# Altium schematic sheet Giao_Thong.SchDoc
size A3
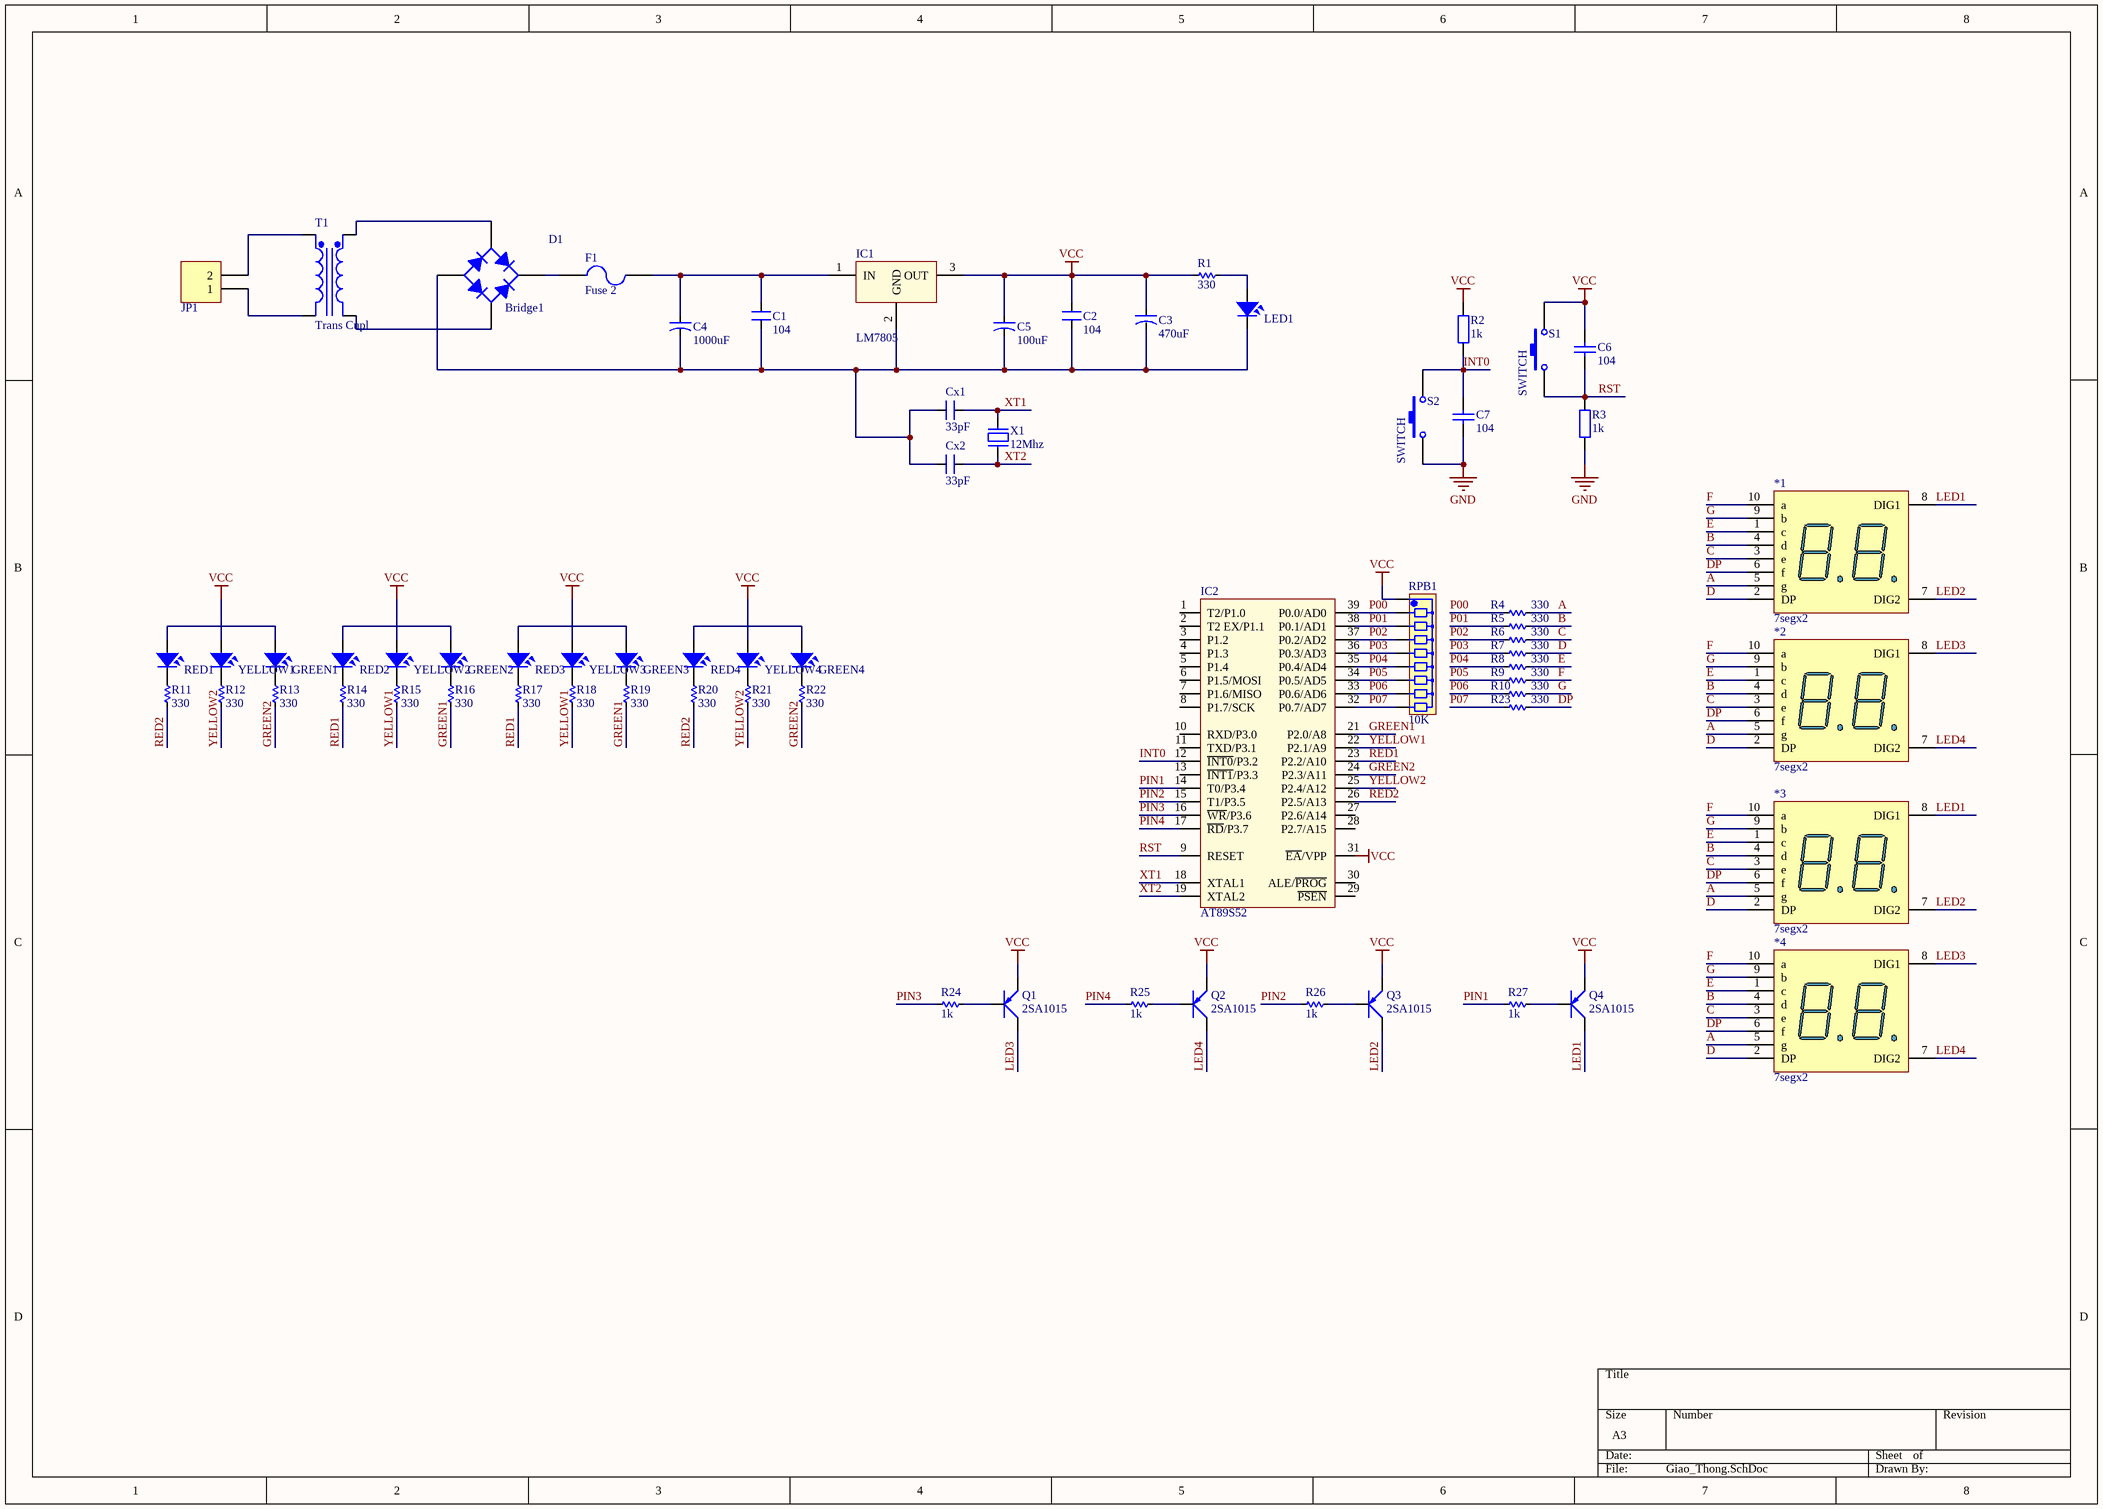
[diagram p0: Giao_Thong.SchDoc]

## Parts
*1  7segx2  [7segx2]
*2  7segx2  [7segx2]
*3  7segx2  [7segx2]
*4  7segx2  [7segx2]
C1  104  [CN2]
C2  104  [CN2]
C3  470uF  [CA-ALU-8]
C4  1000uF  [CA-ALU-8]
C5  100uF  [CA-ALU-8]
C6  104  [0805 CAP]
C7  104  [0805 CAP]
Cx1  33pF  [CN1]
Cx2  33pF  [CN1]
D1  Bridge1  [E-BIP-P4/D10]
F1  Fuse 2  [PIN-W2/E2.8]
GREEN1  LED  [LED-5-Green]  (value not drawn)
GREEN2  LED  [LED-5-Green]  (value not drawn)
GREEN3  LED  [LED-5-Green]  (value not drawn)
GREEN4  LED  [LED-5-Green]  (value not drawn)
IC1  LM7805  [QTO-220]
IC2  AT89S52  [DIP40/W0.6]
JP1  Header 2_1  [HED2]  (value not drawn)
LED1  LED  [LED-5MM-RED]  (value not drawn)
Q1  2SA1015  [TO92-123]
Q2  2SA1015  [TO92-123]
Q3  2SA1015  [TO92-123]
Q4  2SA1015  [TO92-123]
R1  330  [RES-1/4W]
R2  1k  [0805 RESISTOR]
R3  1k  [0805 RESISTOR]
R4  330  [RES-SMD-0805]
R5  330  [RES-SMD-0805]
R6  330  [RES-SMD-0805]
R7  330  [RES-SMD-0805]
R8  330  [RES-SMD-0805]
R9  330  [RES-SMD-0805]
R10  330  [RES-SMD-0805]
R11  330  [RES-SMD-0805]
R12  330  [RES-SMD-0805]
R13  330  [RES-SMD-0805]
R14  330  [RES-SMD-0805]
R15  330  [RES-SMD-0805]
R16  330  [RES-SMD-0805]
R17  330  [RES-SMD-0805]
R18  330  [RES-SMD-0805]
R19  330  [RES-SMD-0805]
R20  330  [RES-SMD-0805]
R21  330  [RES-SMD-0805]
R22  330  [RES-SMD-0805]
R23  330  [RES-SMD-0805]
R24  1k  [RES-SMD-0805]
R25  1k  [RES-SMD-0805]
R26  1k  [RES-SMD-0805]
R27  1k  [RES-SMD-0805]
RED1  LED  [LED-5-RED]  (value not drawn)
RED2  LED  [LED-5-RED]  (value not drawn)
RED3  LED  [LED-5-RED]  (value not drawn)
RED4  LED  [LED-5-RED]  (value not drawn)
RPB1  10K  [RN8]
S1  SWITCH  [SW 4PIN]
S2  SWITCH  [SW 4PIN]
T1  Trans Cupl  [TRF_4]
X1  12Mhz  [XT2]
YELLOW1  LED  [LED-5-Yellow]  (value not drawn)
YELLOW2  LED  [LED-5-Yellow]  (value not drawn)
YELLOW3  LED  [LED-5-Yellow]  (value not drawn)
YELLOW4  LED  [LED-5-Yellow]  (value not drawn)

## Nets
GND: C7.1 IC2.20(GND) R3.2 S2.1
VCC: C2.2 C3.1 C5.1 C6.2 IC1.3(OUT) IC2.31(~{EA}/VPP) IC2.40(VCC) Q1.1(E) Q2.1(E) Q3.1(E) Q4.1(E) R1.2 R2.1 RPB1.1 S1.2 YELLOW1.1 YELLOW2.1 YELLOW3.1 YELLOW4.1
A: *1.5(g) *2.5(g) *3.5(g) *4.5(g) R4.1
B: *1.4(d) *2.4(d) *3.4(d) *4.4(d) R5.1
C: *1.3(e) *2.3(e) *3.3(e) *4.3(e) R6.1
D: *1.2(DP) *2.2(DP) *3.2(DP) *4.2(DP) R7.1
DP: *1.6(f) *2.6(f) *3.6(f) *4.6(f) R23.1
E: *1.1(c) *2.1(c) *3.1(c) *4.1(c) R8.1
F: *1.10(a) *2.10(a) *3.10(a) *4.10(a) R9.1
G: *1.9(b) *2.9(b) *3.9(b) *4.9(b) R10.1
GREEN1: IC2.21(P2.0/A8) R16.1 R19.1
GREEN2: IC2.24(P2.3/A11) R13.1 R22.1
INT0: C7.2 IC2.12(~{INT0}/P3.2) R2.2 S2.2
LED1: *1.8(DIG1) *3.8(DIG1) Q4.2(C)
LED2: *1.7(DIG2) *3.7(DIG2) Q3.2(C)
LED3: *2.8(DIG1) *4.8(DIG1) Q1.2(C)
LED4: *2.7(DIG2) *4.7(DIG2) Q2.2(C)
P00: IC2.39(P0.0/AD0) R4.2 RPB1.2
P01: IC2.38(P0.1/AD1) R5.2 RPB1.3
P02: IC2.37(P0.2/AD2) R6.2 RPB1.4
P03: IC2.36(P0.3/AD3) R7.2 RPB1.5
P04: IC2.35(P0.4/AD4) R8.2 RPB1.6
P05: IC2.34(P0.5/AD5) R9.2 RPB1.7
P06: IC2.33(P0.6/AD6) R10.2 RPB1.8
P07: IC2.32(P0.7/AD7) R23.2 RPB1.9
PIN1: IC2.14(T0/P3.4) R27.2
PIN2: IC2.15(T1/P3.5) R26.2
PIN3: IC2.16(~{WR}/P3.6) R24.2
PIN4: IC2.17(~{RD}/P3.7) R25.2
RED1: IC2.23(P2.2/A10) R14.1 R17.1
RED2: IC2.26(P2.5/A13) R11.1 R20.1
RST: C6.1 IC2.9(RESET) R3.1 S1.1
XT1: Cx1.2 IC2.18(XTAL1) X1.2
XT2: Cx2.2 IC2.19(XTAL2) X1.1
YELLOW1: IC2.22(P2.1/A9) R15.1 R18.1
YELLOW2: IC2.25(P2.4/A12) R12.1 R21.1
NetC1_1: C1.1 C2.1 C3.2 C4.2 C5.2 Cx1.1 Cx2.1 D1.3(A) IC1.2(GND) LED1.2
NetC1_2: C1.2 C4.1 F1.2 IC1.1(IN)
NetD1_1: D1.1(K) F1.1
NetD1_2: D1.2(C) T1.4(Sec-)
NetD1_4: D1.4(C) T1.3(Sec+)
NetGREEN1_1: GREEN1.1 RED1.1
NetGREEN1_2: GREEN1.2 R13.2
NetGREEN2_1: GREEN2.1 RED2.1
NetGREEN2_2: GREEN2.2 R16.2
NetGREEN3_1: GREEN3.1 RED3.1
NetGREEN3_2: GREEN3.2 R19.2
NetGREEN4_1: GREEN4.1 RED4.1
NetGREEN4_2: GREEN4.2 R22.2
NetJP1_1: JP1.1 T1.2(Pri-)
NetJP1_2: JP1.2 T1.1(Pri+)
NetLED1_1: LED1.1 R1.1
NetQ1_3: Q1.3(B) R24.1
NetQ2_3: Q2.3(B) R25.1
NetQ3_3: Q3.3(B) R26.1
NetQ4_3: Q4.3(B) R27.1
NetR11_2: R11.2 RED1.2
NetR12_2: R12.2 YELLOW1.2
NetR14_2: R14.2 RED2.2
NetR15_2: R15.2 YELLOW2.2
NetR17_2: R17.2 RED3.2
NetR18_2: R18.2 YELLOW3.2
NetR20_2: R20.2 RED4.2
NetR21_2: R21.2 YELLOW4.2

Not connected (* = marked no-connect by the designer): IC2 1(T2/P1.0) 2(T2_EX/P1.1) 3(P1.2) 4(P1.3) 5(P1.4) 6(P1.5/MOSI) 7(P1.6/MISO) 8(P1.7/SCK) 10(RXD/P3.0) 11(TXD/P3.1) 13(~{INT1}/P3.3) 27(P2.6/A14) 28(P2.7/A15) 29(~{PSEN}) 30(ALE/~{PROG})

## Library data of the parts
C1 C2 = CN2: Cap np 104 => 105pF; Value: 0.1uF
C3-C5 = CN-ALU-DIP: Capacitor (Semiconductor SIM Model); Value: 104; LatestRevisionDate: 17-Jul-2002; LatestRevisionNote: Re-released for DXP Platform.; PackageReference: C1206; Publisher: Altium Limited
C6 C7 = CAP CERAMIC: Published: 8-Jun-2000; LatestRevisionDate: 17-Jul-2002; LatestRevisionNote: Re-released for DXP Platform.; PackageReference: RAD-0.3; Publisher: Altium Limited
Cx1 Cx2 = CN: Value: 33pF
D1 = Bridge1: Full Wave Diode Bridge; Published: 8-Jun-2000; LatestRevisionDate: 29-May-2009; LatestRevisionNote: Sch pins A & K swapped.; DatasheetVersion: E2732B; PackageReference: D-38; Publisher: Altium Limited
F1 = Fuse 2: Fuse; Published: 8-Jun-2000; LatestRevisionDate: 17-Jul-2002; LatestRevisionNote: Re-released for DXP Platform.; PackageReference: PIN-W2/E2.8; Publisher: Altium Limited
GREEN1-GREEN4 LED1 RED1-RED4 YELLOW1-YELLOW4 = LED: LED Single colour Green and Red; Value: LED 3 ly Single Colour
IC1 = LM78xx: On ap +, from + 5 to + 24VDC; Value: LM7805
IC2 = AT89S52: AT89S52, 8k Byte Flash Memory , 40 Pin; Value: AT89S52
JP1 = Header 2_1: Header, 2-Pin; Manufacturer: Generic Components; Class: Connector; Value: Header 2
Q1-Q4 = 2SA1015: PNP 600mW, ECB; Value: A1015
R1 = Res: Manufacturer: Generic Components; Class: Passive; SubClass: R; Published: 08/06/2000; Publisher: Altium Hobart Technology Centre
R2 R3 = RESISTOR: Value: R1/4W - 1K
R4-R27 = Res-SMD: Resistor; Manufacturer: Generic Components; Class: Passive; Published: 08/06/2000; Publisher: Altium Hobart Technology Centre
RPB1 = RN8: Resistor 8 (Thanh); Value: Tro thanh 10K
T1 = Trans Cupl: Transformer (Coupled Inductor Model); Published: 8-Jun-2000; LatestRevisionDate: 17-Jul-2002; LatestRevisionNote: Re-released for DXP Platform.; PackageReference: TRF_4; Publisher: Altium Limited
X1 = XT2: Crystal, 32.768 KHz, -40 to 85 degC, 3.2 x 1.5 x 0.9 mm SMD; Value: 4Mhz
S1 S2 = SWITCH: Published: 24-Mar-1999; LatestRevisionDate: 17-Jul-2002; LatestRevisionNote: Re-released for DXP Platform.; PackageReference: SPST-2; Publisher: Altium Limited